# EAGLE design daisyboard (EAGLE 9.6.2)
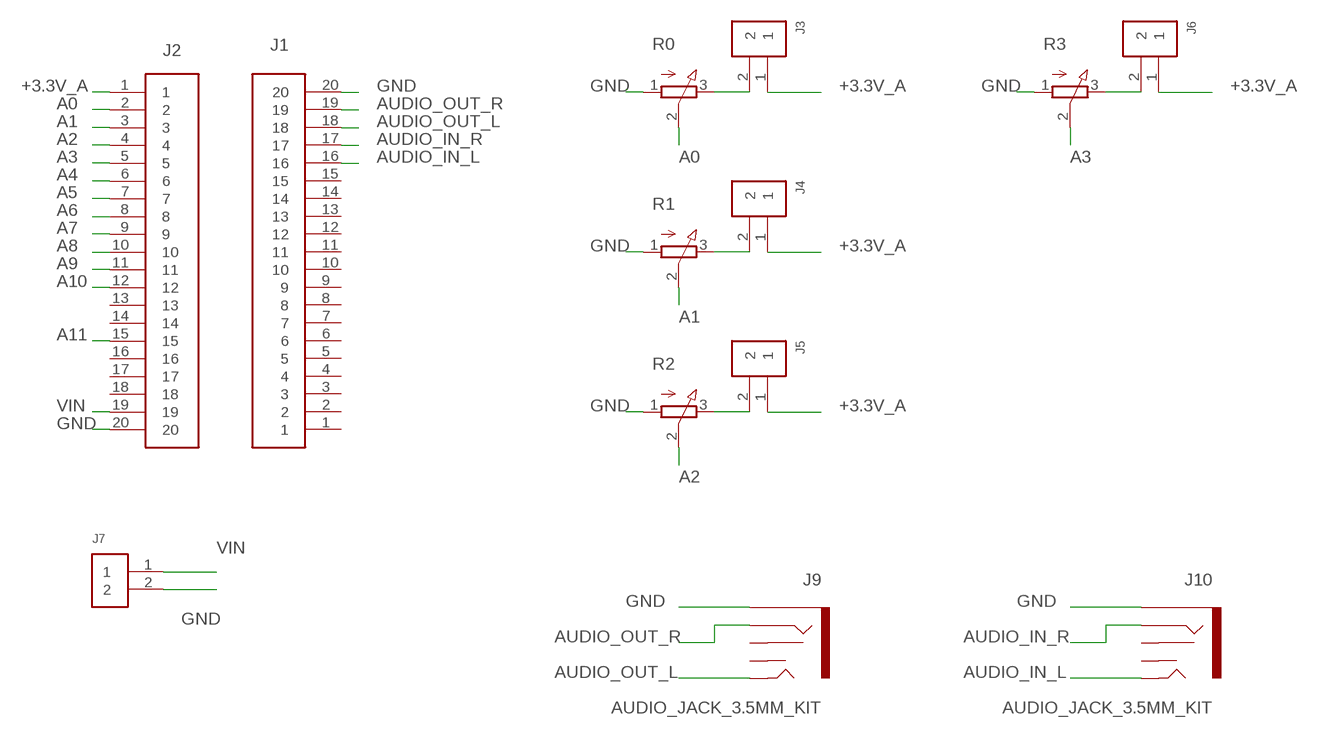
[diagram p0: schematic, sheet 1]

## Parts
J1  61302011121  [61302011121]
J2  61302011121  [61302011121]
J3  61300211121  [61300211121]
J4  61300211121  [61300211121]
J5  61300211121  [61300211121]
J6  61300211121  [61300211121]
J7  61300211121  [61300211121]
J9  AUDIO_JACK_3.5MM_KIT  [AUDIO-JACK-KIT]
J10  AUDIO_JACK_3.5MM_KIT  [AUDIO-JACK-KIT]
R0  3RP/1610N  [3RP/1610N]
R1  3RP/1610N  [3RP/1610N]
R2  3RP/1610N  [3RP/1610N]
R3  3RP/1610N  [3RP/1610N]

## Nets
+3.3V_A: J2.1 J3.1 J4.1 J5.1 J6.1
A0: J2.2 R0.2(S)
A1: J2.3 R1.2(S)
A2: J2.4 R2.2(S)
A3: J2.5 R3.2(S)
A4: J2.6
A5: J2.7
A6: J2.8
A7: J2.9
A8: J2.10
A9: J2.11
A10: J2.12
A11: J2.15
AUDIO_IN_L: J1.16 J10.TIP
AUDIO_IN_R: J1.17 J10.RING
AUDIO_OUT_L: J1.18 J9.TIP
AUDIO_OUT_R: J1.19 J9.RING
GND: J1.20 J2.20 J7.2 J9.SLEEVE J10.SLEEVE R0.1(A) R1.1(A) R2.1(A) R3.1(A)
N$1: J3.2 R0.3(E)
N$2: J4.2 R1.3(E)
N$3: J5.2 R2.3(E)
N$4: J6.2 R3.3(E)
VIN: J2.19 J7.1
Unconnected: J1.1 J1.2 J1.3 J1.4 J1.5 J1.6 J1.7 J1.8 J1.9 J1.10 J1.11 J1.12 J1.13 J1.14 J1.15 J2.13 J2.14 J2.16 J2.17 J2.18 J9.RSH J9.TSH J10.RSH J10.TSH

## Library data of the parts
J1 J2 = Headers:61302011121: CONN HEADER VERT 20POS 2.54MM Manufacturer's datasheet <https://katalog.we-online.de/em/datasheet/6130xx11121.pdf>; CREATED_BY: PCBLayout.com; DIGIKEY_PART_NUMBER: 732-5329-ND; MANUFACTURER: Wurth Electronics Inc.; MPN: 61302011121
J3-J7 = Headers:61300211121: CONN HEADER VERT 2POS 2.54MM Manufacturer's datasheet <https://katalog.we-online.de/em/datasheet/6130xx11121.pdf>; CREATED_BY: PCBLayout.com; DIGI_KEY_PART_NUMBER: 732-5315-ND; MANUFACTURER: Wurth Electronics Inc.; MPN: 61300211121
J9 J10 = SparkFun-Connectors:AUDIO_JACK_3.5MM: Audio Jack 3.5mm variants of PTH and SMT stereo audio jack with bypass switches. SparkFun Products: SparkFun SparkPunk Sound Kit <[https://www.sparkfun.com/products/11177]> - PTH MP3 Trigger <https://www.sparkfun.com/products/13720> -3.5mm SMD SparkFun PicoBoard <https://www.sparkfun.com/products/11888>- 2.5mm SMD; PROD_ID: CONN-08774; SF_ID: PRT-08032
R0 R1-R3 = pot:3RP/1610N: 16mm Potentiometer one level Source: http://www.alphapotentiometers.net/html/16mm_pot_2.html

## Board
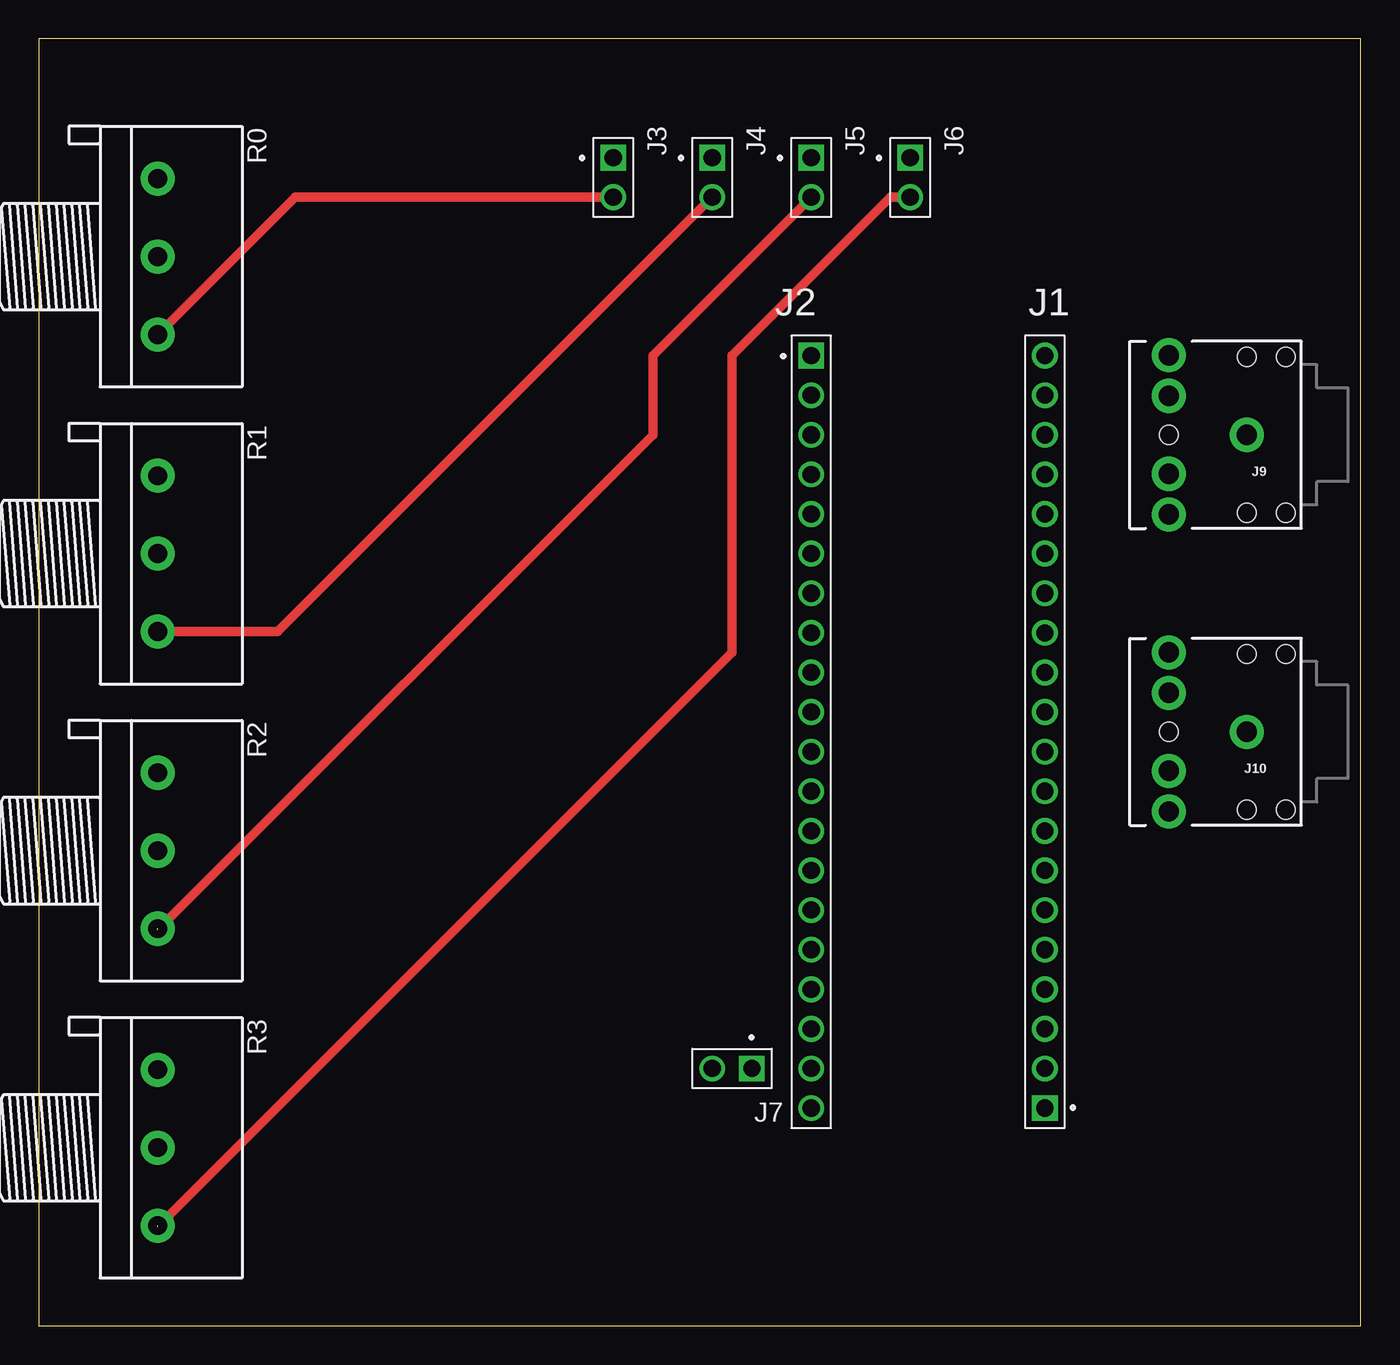
[diagram p1: board, top side]
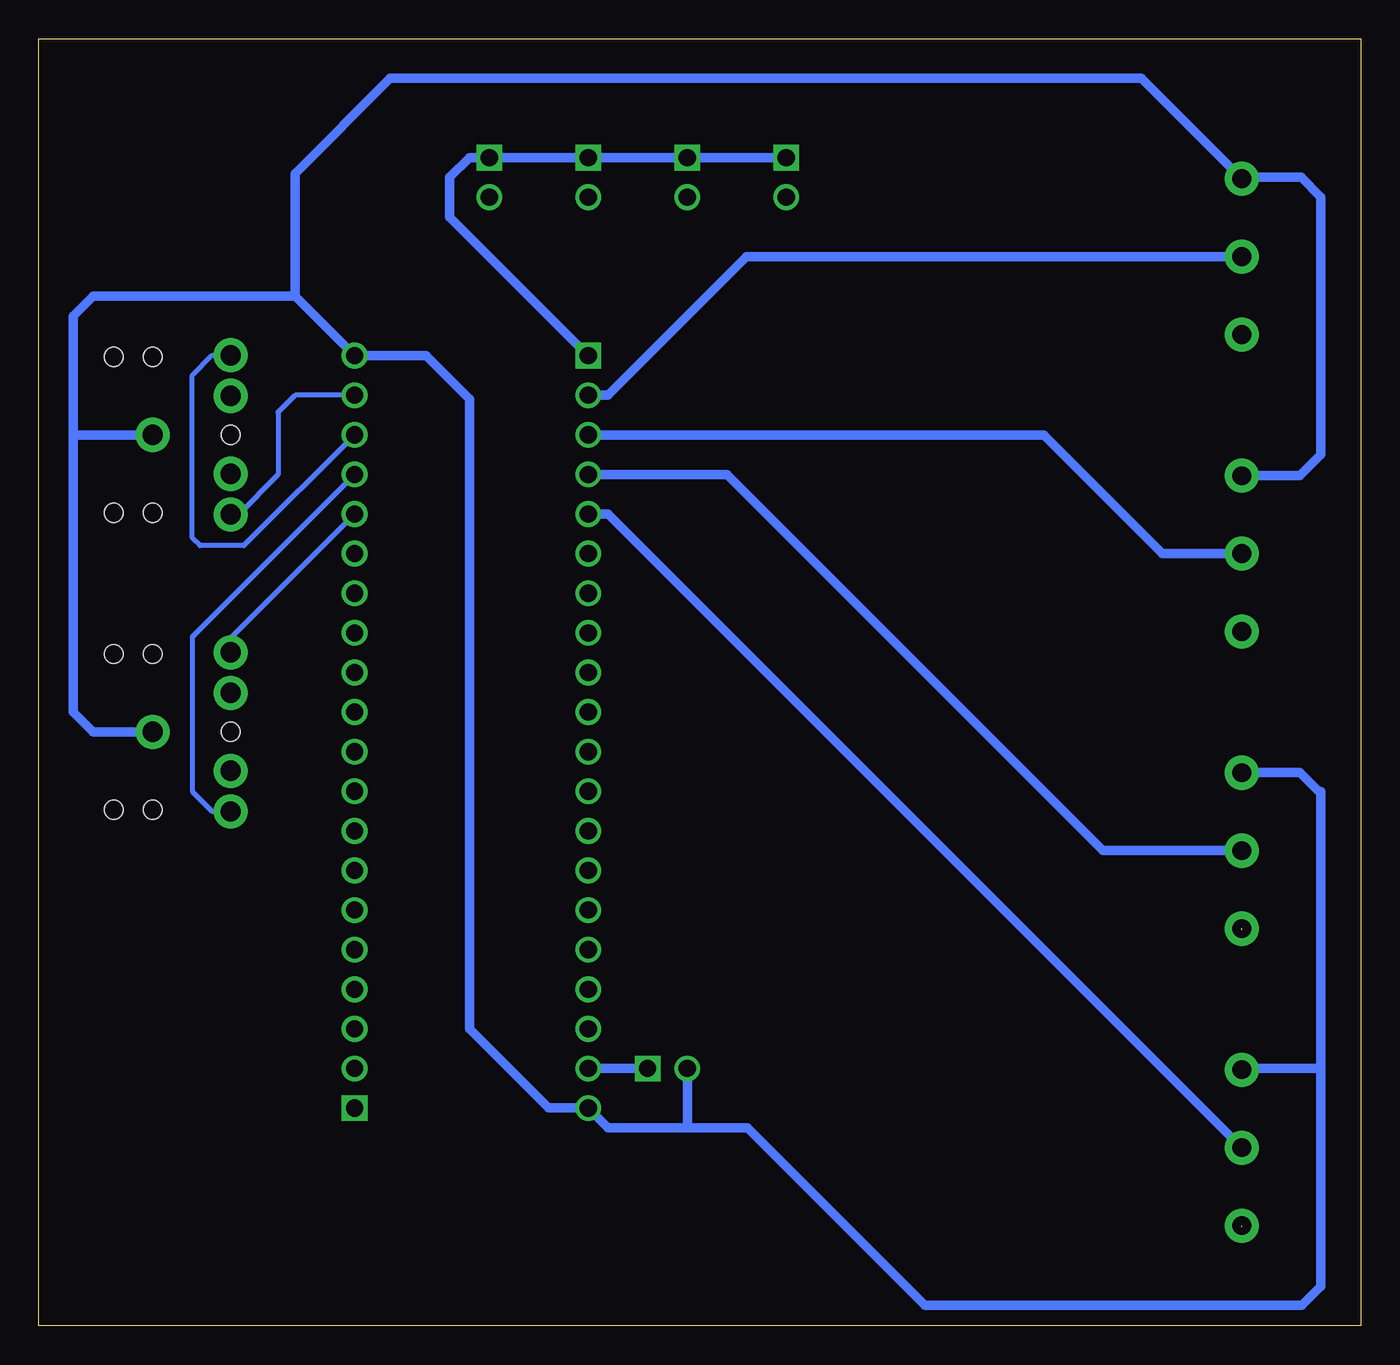
[diagram p2: board, bottom side, seen from below]

Size 84.76 x 82.54 mm. Coordinates in mm from the lower left corner, seen from the top.
Outline: 0,0 84.76,0 84.76,82.54 0,82.54 0,0
Copper layers (1*16): Top 0.035mm / dielectric 1.5mm / Bottom 0.035mm
Design rules "default": minimum track width 6mil, minimum drill 0.35mm, track to track 6mil, track to pad 6mil, pad to pad 6mil, via to via 6mil, smd to smd 6mil, copper to edge 40mil, drill to drill 6mil, minimum pad ring 10mil, minimum via ring 8mil, stop-mask expansion 4mil, vias tented up to drill 0mil, thermal gap 10mil

### Footprints (pad centres in the part's own frame; a part is rotated, then mirrored left to right if it is on the bottom)
61302011121 = drill 1.1 square: 1 -24.13,0 | drill 1.1: 2 -21.59,0; 3 -19.05,0; 4 -16.51,0; 5 -13.97,0; 6 -11.43,0; 7 -8.89,0; 8 -6.35,0; 9 -3.81,0; 10 -1.27,0; 11 1.27,0; 12 3.81,0; 13 6.35,0; 14 8.89,0; 15 11.43,0; 16 13.97,0; 17 16.51,0; 18 19.05,0; 19 21.59,0; 20 24.13,0
61300211121 = drill 1.1 square: 1 -1.27,0 | drill 1.1: 2 1.27,0
AUDIO-JACK-KIT = drill 1.3 pad 2.184: RING 5,5.1; RSH 5,2.5; SLEEVE 0,0; TIP 5,-5.1; TSH 5,-2.5 | hole 1.2: 0,5; -2.5,5; -2.5,-5; 0,-5; 5,0
3RP/1610N = drill 1.2 pad 2.184: 1 -5,0; 2 0,0; 3 5,0

### Placement (x,y rotation side)
J1  64.52,38.1 90 top
J2  49.53,38.1 270 top
J3  36.83,73.66 270 top
J4  43.18,73.66 270 top
J5  49.53,73.66 270 top
J6  55.88,73.66 270 top
J7  44.45,16.51 180 top
J9  77.47,57.15 180 top
J10  77.47,38.1 180 top
R0  7.62,68.58 270 top
R1  7.62,49.53 270 top
R2  7.62,30.48 270 top
R3  7.62,11.43 270 top

### Tracks (layer width: path | path; a pad name or v marks a point on that pad's centre or on a via)
+3.3V_A
  Bottom 0.61: J2.1 58.42,71.12 58.42,73.66 57.15,74.93 J6.1 J5.1 J4.1 J3.1
A0
  Bottom 0.61: R0.2 39.37,68.58 48.26,59.69 J2.2
A1
  Bottom 0.61: R1.2 12.7,49.53 20.32,57.15 J2.3
A2
  Bottom 0.61: R2.2 16.51,30.48 40.64,54.61 J2.4
A3
  Bottom 0.61: R3.2 48.26,52.07 J2.5
AUDIO_IN_L
  Bottom 0.305: J1.16 72.47,44.12 J10.TIP
AUDIO_IN_R
  Bottom 0.305: J1.17 74.93,44.2 74.93,34.29 73.64,33 J10.RING
AUDIO_OUT_L
  Bottom 0.305: J1.18 71.63,50.04 74.42,50.04 74.93,50.55 74.93,60.96 73.64,62.25 J9.TIP
AUDIO_OUT_R
  Bottom 0.305: J1.19 68.33,59.69 69.42,58.59 69.42,54.59 71.96,52.05 J9.RING
GND
  Bottom 0.61: 68.33,66.04 J1.20 59.94,62.23 57.15,59.44 57.15,19.05 52.07,13.97 J2.20 48.26,12.7 43.18,12.7 | 68.33,66.04 81.28,66.04 82.55,64.77 82.55,57.15 | 82.55,57.15 82.55,39.37 81.28,38.1 J10.SLEEVE | J9.SLEEVE 82.55,57.15 | 2.54,16.51 2.54,2.54 3.76,1.32 27.94,1.32 39.32,12.7 43.18,12.7 | 2.54,16.51 2.54,34.29 2.62,34.21 3.89,35.48 R2.1 | R3.1 7.54,16.51 2.54,16.51 | R1.1 3.89,54.53 2.54,55.88 2.54,72.39 3.81,73.66 7.54,73.66 R0.1 14.05,80.01 62.23,80.01 68.33,73.91 68.33,66.04 | J7.2 43.18,12.7
N$1
  Top 0.61: R0.3 16.43,72.39 J3.2
N$2
  Top 0.61: J4.2 15.32,44.53 R1.3
N$3  (1 unrouted)
  Top 0.61: J5.2 39.37,62.23 39.37,57.15 7.62,25.4
N$4  (1 unrouted)
  Top 0.61: J6.2 54.61,72.39 44.45,62.23 44.45,43.18 7.62,6.35
VIN
  Bottom 0.61: J7.1 J2.19